# EAGLE design tvbgone (EAGLE 7.5.0)
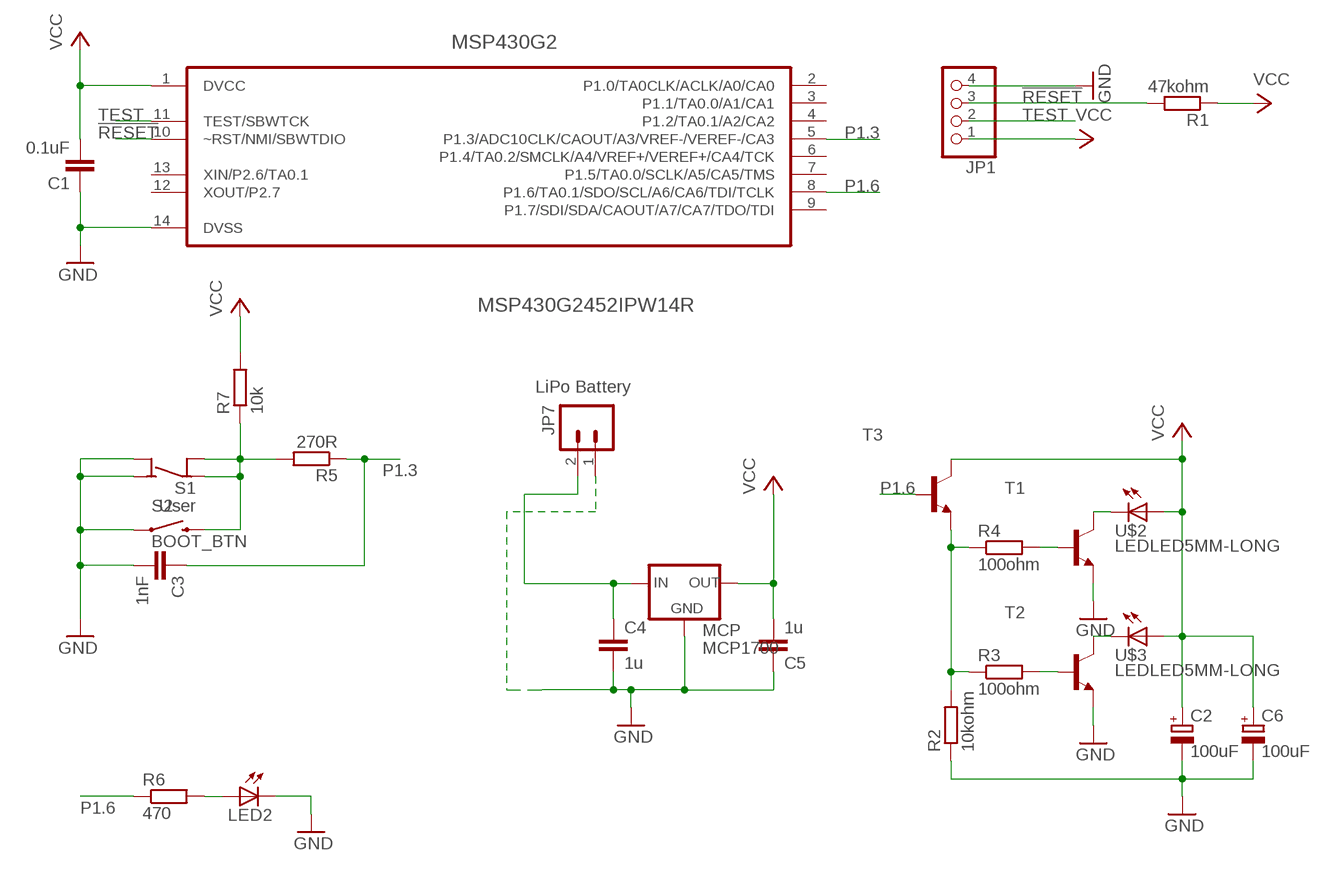
[diagram p0: schematic, sheet 1]

## Parts
C1  0.1uF  C-EUC0805  [C0805]
C2  100uF  CPOL-EU153CLV-0505  [153CLV-0505]
C3  1nF  C-EUC0805  [C0805]
C4  1u  C-EUC0805  [C0805]
C5  1u  C-EUC0805  [C0805]
C6  100uF  CPOL-EUE3.5-8  [E3,5-8]
JP1  PINHD-1X4  [1X04]
JP7  LiPo Battery  M02JST-PTH-2  [JST-2-PTH]
LED2  0  LEDCHIPLED_1206  [CHIPLED_1206]
MCP  MCP1700  MCP1700SOT-23  [SOT-23]
MSP430G2  MSP430G2452IPW14R  [SOP65P640X120-14N]
R1  47kohm  R-EU_R0805  [R0805]
R2  10kohm  R-EU_R0805  [R0805]
R3  100ohm  R-EU_R0805  [R0805]
R4  100ohm  R-EU_R0805  [R0805]
R5  270R  R-EU_R0805  [R0805]
R6  470  R-EU_R0805  [R0805]
R7  10k  R-EU_R0805  [R0805]
S1  User  SPST4  [6MMTACTILE_4PIN]
S2  BOOT_BTN  SWITCH-MOMENTARY-2-SMD-1101NE  [TACTILE-SWITCH-1101NE]
T1  MMBT2222ALT1-NPN-SOT23-BEC  [SOT23-BEC]
T2  MMBT2222ALT1-NPN-SOT23-BEC  [SOT23-BEC]
T3  MMBT2222ALT1-NPN-SOT23-BEC  [SOT23-BEC]
U$2  LEDLED5MM-LONG  [LED5MM-LONG]
U$3  LEDLED5MM-LONG  [LED5MM-LONG]

## Nets
!RESET: JP1.3 MSP430G2.10(~RST/NMI/SBWTDIO) R1.2
GND [GND]: C1.1 C2.- C3.2 C4.2 C5.1 C6.- JP1.4 JP7.1 LED2.C MCP.1(GND) MSP430G2.14(DVSS) R2.1 S1.A1(NO) S1.A2(NO) S2.1 T1.E T2.E
N$1: R5.2 R7.1 S1.B1(COM) S1.B2(COM) S2.2
N$3: R2.2 R3.1 R4.1 T3.E
N$4: T2.C U$3.C
N$5: T1.C U$2.C
N$6: R4.2 T1.B
N$7: R3.2 T2.B
N$14: LED2.A R6.2
P1.3: C3.1 MSP430G2.5(P1.3/ADC10CLK/CAOUT/A3/VREF-/VEREF-/CA3) R5.1
P1.6: MSP430G2.8(P1.6/TA0.1/SDO/SCL/A6/CA6/TDI/TCLK) R6.1 T3.B
TEST: JP1.2 MSP430G2.11(TEST/SBWTCK)
VCC [VCC]: C1.2 C2.+ C5.2 C6.+ JP1.1 MCP.2(OUT) MSP430G2.1(DVCC) R1.1 R7.2 T3.C U$2.A U$3.A
VCCEXT [VCC]: C4.1 JP7.2 MCP.3(IN)
Unconnected: MSP430G2.2(P1.0/TA0CLK/ACLK/A0/CA0) MSP430G2.3(P1.1/TA0.0/A1/CA1) MSP430G2.4(P1.2/TA0.1/A2/CA2) MSP430G2.6(P1.4/TA0.2/SMCLK/A4/VREF+/VEREF+/CA4/TCK) MSP430G2.7(P1.5/TA0.0/SCLK/A5/CA5/TMS) MSP430G2.9(P1.7/SDI/SDA/CAOUT/A7/CA7/TDO/TDI) MSP430G2.12(XOUT/P2.7) MSP430G2.13(XIN/P2.6/TA0.1)

## Library data of the parts
C1 C3 = resistor:C-EU: CAPACITOR, European symbol
C2 C6 = resistor:CPOL-EU: POLARIZED CAPACITOR, European symbol
C4 C5 = rcl:C-EU: CAPACITOR, European symbol
JP1 = 43oh-SugarAddict:PINHD-1X4: PIN HEADER
JP7 = SparkFun:M02: Header 2 Standard 2-pin 0.1" header. Use with straight break away headers (SKU : PRT-00116), right angle break away headers (PRT-00553), swiss pins (PRT-00743), machine pins (PRT-00117), and female headers (PRT-00115). Molex polarized connector foot print use with SKU : PRT-08233 with associated crimp pins and housings.
LED2 = led:LED: LED OSRAM: - CHIPLED LG R971, LG N971, LY N971, LG Q971, LY Q971, LO R971, LY R971 LH N974, LH R974 LS Q976, LO Q976, LY Q976 LO Q996 - Hyper CHIPLED LW Q18S LB Q993, LB Q99A, LB R99A - SideLED LS A670, LO A670, LY A670, LG A670, LP A670 LB A673, LV A673, LT A673, LW A673 LH A674 LY A675 LS A676, LA A676, LO A676, LY A676, LW A676 LS A679, LY A679, LG A679 - Hyper Micro SIDELED® LS Y876, LA Y876, LO Y876, LY Y876 LT Y87S - SmartLED LW L88C, LW L88S LB L89C, LB L89S, LG L890 LS L89K, LO L89K, LY L89K LS L896, LA L896, LO L896, LY L896 - TOPLED LS T670, LO T670, LY T670, LG T670, LP T670 LSG T670, LSP T670, LSY T670, LOP T670, LYG T670 LG T671, LOG T671, LSG T671 LB T673, LV T673, LT T673, LW T673 LH T674 LS T676, LA T676, LO T676, LY T676, LB T676, LH T676, LSB T676, LW T676 LB T67C, LV T67C, LT T67C, LS T67K, LO T67K, LY T67K, LW E67C LS E67B, LA E67B, LO E67B, LY E67B, LB E67C, LV E67C, LT E67C LW T67C LS T679, LY T679, LG T679 LS T770, LO T770, LY T770, LG T770, LP T770 LB T773, LV T773, LT T773, LW T773 LH T774 LS E675, LA E675, LY E675, LS T675 LS T776, LA T776, LO T776, LY T776, LB T776 LHGB T686 LT T68C, LB T68C - Hyper Mini TOPLED® LB M676 - Mini TOPLED Santana® LG M470 LS M47K, LO M47K, LY M47K Source: http://www.osram.convergy.de LUXEON: - LUMILED® LXK2-PW12-R00, LXK2-PW12-S00, LXK2-PW14-U00, LXK2-PW14-V00 LXK2-PM12-R00, LXK2-PM12-S00, LXK2-PM14-U00 LXK2-PE12-Q00, LXK2-PE12-R00, LXK2-PE12-S00, LXK2-PE14-T00, LXK2-PE14-U00 LXK2-PB12-K00, LXK2-PB12-L00, LXK2-PB12-M00, LXK2-PB14-N00, LXK2-PB14-P00, LXK2-PB14-Q00 LXK2-PR12-L00, LXK2-PR12-M00, LXK2-PR14-Q00, LXK2-PR14-R00 LXK2-PD12-Q00, LXK2-PD12-R00, LXK2-PD12-S00 LXK2-PH12-R00, LXK2-PH12-S00 LXK2-PL12-P00, LXK2-PL12-Q00, LXK2-PL12-R00 Source: www.luxeon.com KINGBRIGHT: KA-3528ASYC Source: www.kingbright.com
MCP = MY_IC:MCP1700
MSP430G2 = thierry_eagle:MSP430G2452IPW14R: MIXED SIGNAL MICROCONTROLLER; MPN: MSP430G2452IPW14R; OC_FARNELL: 1865385; OC_NEWARK: 21T2342; PACKAGE: TSSOP-14; SUPPLIER: Texas Instruments
R1-R7 = resistor:R-EU_: RESISTOR, European symbol
S1 = mes_electromech:SPST4: SPST switch with 2 pins per contact
S2 = SparkFun-Electromechanical:SWITCH-MOMENTARY-2: Various NO switches- pushbuttons, reed, etc
T1-T3 = transistor:*-NPN-: NPN Transistror BF959 corrected 2008.03.06
U$2 U$3 = 43oh-SugarAddict:LED

## Net classes
0 default: width 0.305 mm, drill 0.508 mm
1 GND: width 0.508 mm, drill 0.508 mm
2 VCC: width 0.508 mm, drill 0.508 mm

## Board
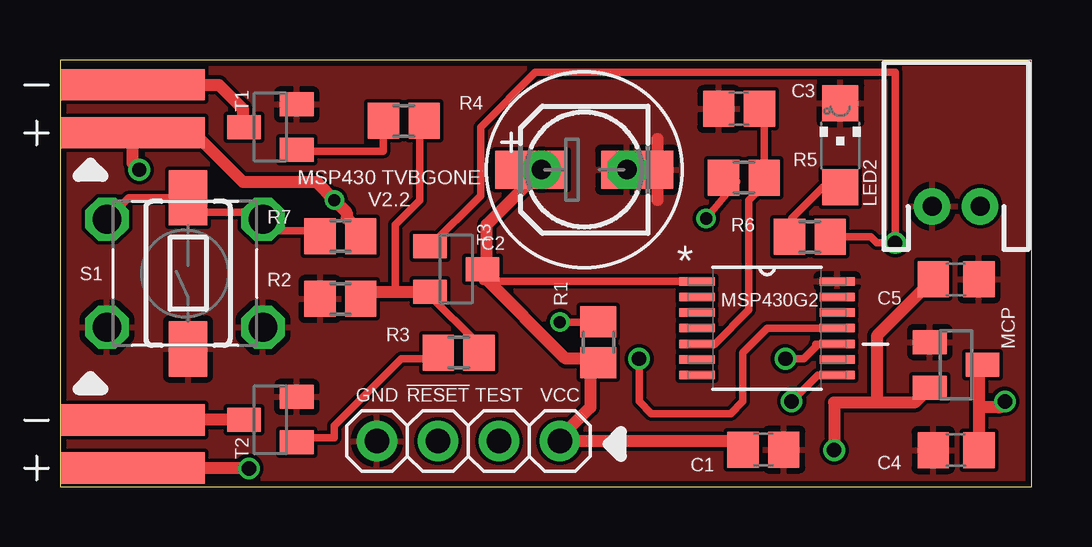
[diagram p1: board, top side]
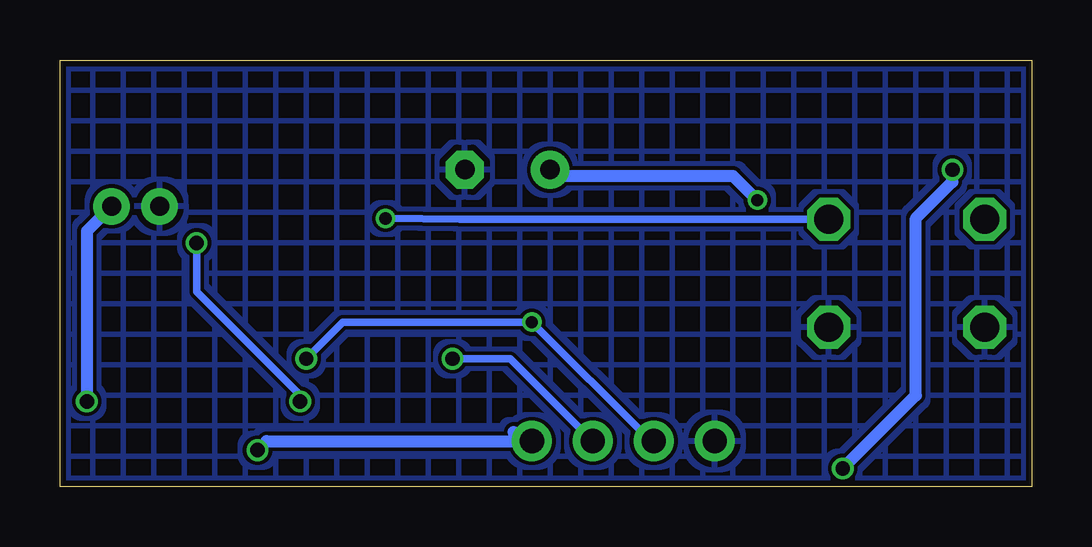
[diagram p2: board, bottom side, seen from below]

Size 40.49 x 17.78 mm. Coordinates in mm from the lower left corner, seen from the top.
Outline: 0,0 40.49,0 40.49,17.78 0,17.78 0,0
Copper layers (1*16): Top 0.035mm / dielectric 1.5mm / Bottom 0.035mm
Design rules "default": minimum track width 6mil, minimum drill 12mil, track to track 6mil, track to pad 6mil, pad to pad 6mil, via to via 6mil, smd to smd 0mil, copper to edge 10mil, drill to drill 10mil, minimum pad ring 10mil, minimum via ring 6mil, stop-mask expansion 2mil, vias tented up to drill 100mil, thermal gap 10mil

### Footprints (pad centres in the part's own frame; a part is rotated, then mirrored left to right if it is on the bottom)
C0805 = smd 1.3 x 1.5: 1 -0.85,0; 2 0.85,0
153CLV-0505 = smd 3 x 1.6: + 2.2,0; - -2.2,0
C0805' = smd 1.3 x 1.5: 1 -0.95,0; 2 0.95,0
E3,5-8 = drill 0.813 pad 1.6: + -1.778,0 | drill 0.813 pad 1.6 octagon: - 1.778,0
1X04 = drill 1.016 pad 1.676: 1 -3.81,0; 2 -1.27,0; 3 1.27,0; 4 3.81,0
JST-2-PTH = drill 0.787 pad 1.524: 1 -1,0; 2 1,0
CHIPLED_1206 = smd 1.5 x 1.5: A 0,-1.75; C 0,1.75
SOT-23 = smd 1 x 1.4: 1 -0.95,-1.1; 2 0.95,-1.1; 3 0,1.1
SOP65P640X120-14N = smd 1.473 x 0.356: 1 -2.921,1.956; 2 -2.921,1.295; 3 -2.921,0.66; 4 -2.921,0; 5 -2.921,-0.66; 6 -2.921,-1.295; 7 -2.921,-1.956; 8 2.921,-1.956; 9 2.921,-1.295; 10 2.921,-0.66; 11 2.921,0; 12 2.921,0.66; 13 2.921,1.295; 14 2.921,1.956
R0805 = smd 1.3 x 1.5: 1 -0.85,0; 2 0.85,0
6MMTACTILE_4PIN = drill 1.2 octagon: A1 3.25,-2.25; A2 -3.25,-2.25; B1 3.25,2.25; B2 -3.25,2.25
TACTILE-SWITCH-1101NE = smd 2.3 x 1.6: 1 -3.15,0; 2 3.15,0
SOT23-BEC = smd 1 x 1.4: B -0.95,-1.1; C 0,1.1; E 0.95,-1.1
LED5MM-LONG = smd 6 x 1.3: A 0,-1; C 0,1

### Placement (x,y rotation side)
C1  29.31,1.55 180 top
C2  21.84,13.21 180 top
C3  28.3,15.75 180 top
C4  1u  [C0805']  37.34,1.52 180 top
C5  1u  [C0805']  37.34,8.64 180 top
C6  21.84,13.21 0 top
JP1  17.02,1.91 180 top
JP7  37.34,11.68 0 top
LED2  32.51,14.22 0 top
MCP  37.34,5.08 270 top
MSP430G2  29.46,6.6 0 top
R1  22.43,6.02 90 top
R2  11.68,7.82 0 top
R3  16.61,5.59 180 top
R4  14.33,15.24 180 top
R5  28.5,12.88 180 top
R6  31.24,10.41 180 top
R7  11.68,10.44 0 top
S1  5.21,8.89 0 top
S2  5.33,8.89 90 top
T1  8.76,14.99 90 top
T2  8.76,2.79 90 top
T3  16.51,9.07 270 top
U$2  3.02,15.75 0 top
U$3  3.02,1.78 0 top

### Tracks (layer width: path | path; a pad name or v marks a point on that pad's centre or on a via)
!RESET  (via drill 0.51, 0.6)
  Top 0.305: v20.83,6.86 22.42,6.86 R1.2 | MSP430G2.10 31.5,5.94 31.5,5.84 30.99,5.33 v30.23,5.33
  Bottom 0.305: JP1.3 15.75,2.03 16,2.03 v20.83,6.86 28.7,6.86 v30.23,5.33
GND
  Top 0.508: 24.89,14.48 24.89,11.94
  pour Top: 0,17.78 0,0 40.49,0 40.49,17.78
  pour Bottom (hatched): 0,17.78 0,0 40.49,0 40.49,17.78
N$1  (via drill 0.51)
  Top 0.305: R7.1 10.67,10.67 8.93,10.67 S1.B1 8.17,11.43 5.33,11.43 S2.2 2.86,12.04 S1.B2 | v26.92,11.18 28.19,12.7 R5.2
  Bottom 0.305: v26.92,11.18 23.84,11.14 S1.B1
N$3
  Top 0.305: 12.7,8.13 12.7,7.87 R2.2 | 15.24,8.13 T3.E 15.49,7.87 17.27,6.1 17.27,5.59 R3.1 | 13.97,8.13 13.97,10.92 14.99,11.94 14.99,15.24 R4.1
  Top 0.508: 12.7,8.13 13.97,8.13 15.24,8.13
N$4
  Top 0.508: T2.C 3.04,2.79 U$3.C
N$5
  Top 0.508: U$2.C 6.62,16.75 7.62,15.75 7.62,15.03 T1.C
N$6
  Top 0.305: T1.B 9.91,13.97 13.46,13.97 13.46,15.24 R4.2
N$7
  Top 0.305: T2.B 9.91,2.03 11.43,2.03 11.43,2.54 14.22,5.33 15.75,5.33 15.75,5.59 R3.2
N$14
  Top 0.305: LED2.A 31.78,12.47 30.48,11.18 30.48,10.5 R6.2
P1.3
  Top 0.305: 29.21,15.75 C3.1 29.35,15.7 R5.1 29.21,12.74 29.21,12.45 28.7,11.94 28.7,7.37 27.28,5.94 MSP430G2.5
P1.6  (via drill 0.6)
  Top 0.305: T3.B 17.53,12.13 17.53,14.99 19.81,17.27 34.8,17.27 v34.8,10.16 34.04,10.16 33.78,10.41 R6.1 | MSP430G2.8 31.57,4.65 v30.48,3.56
  Bottom 0.305: v30.48,3.56 30.48,3.81 34.8,8.13 v34.8,10.16
TEST  (via drill 0.6)
  Top 0.305: 24.26,5.46 v24.13,5.33 24.13,3.56 24.64,3.05 27.94,3.05 28.45,3.56 28.45,5.59 29.46,6.6 MSP430G2.11
  Bottom 0.305: JP1.2 21.72,5.33 v24.13,5.33
VCC  (via drill 0.51, 0.6)
  Top 0.305: MSP430G2.1 17.61,8.56 T3.C
  Top 0.508: R7.2 12.45,10.67 11.94,11.18 11.94,11.43 v11.43,11.94 10.67,12.7 7.62,12.7 5.59,14.73 3.04,14.73 U$2.A 3.02,13.49 v3.3,13.21 | 22.1,5.33 22.35,5.33 R1.1 22.1,5.33 | 22.1,5.33 21.08,5.33 17.61,8.81 T3.C | 17.78,8.89 T3.C | T3.C 17.78,9.14 17.78,10.92 C6.+ 20.07,13.04 C2.+ | 22.1,5.33 22.1,3.3 20.83,2.03 JP1.1 28.11,1.91 C1.2 | v32.26,1.52 32.26,3.5 34.04,3.5 | MCP.2 35.61,3.5 34.04,3.5 | C5.2 34.04,6.28 34.04,3.5 | v7.87,0.76 3.04,0.76 U$3.A
  Bottom 0.508: 21.59,2.29 21.34,2.03 20.83,2.03 JP1.1 31.88,1.91 v32.26,1.52 | v11.43,11.94 12.45,12.95 19.56,12.95 19.81,13.21 C6.+ | v7.87,0.76 4.83,3.81 4.83,11.18 3.3,12.7 v3.3,13.21
VCCEXT  (via drill 0.6)
  Top 0.508: MCP.3 38.29,4.93 38.29,3.3 | 38.29,3.3 C4.1 | v39.37,3.56 39.12,3.3 38.29,3.3
  Bottom 0.508: JP7.2 39.37,10.65 v39.37,3.56

### Text on the board
tNames: MSP430 TVBGONE / V2.2 | GND | !RESET | TEST | VCC